# Altium schematic sheet HDMI_Extension_Schematics.SchDoc: HDMI level shifter
size B; Date: 4/26/2019; Author: Altay Brusan; CompanyName: Bogazici University; DrawnBy: Altay Brusan; Engineer: Altay Brusan; DocumentNumber: 1; Revision: 1; SheetNumber: 1; SheetTotal: 1; DocumentName: HDMI level shifter board; ProjectName: iBEX
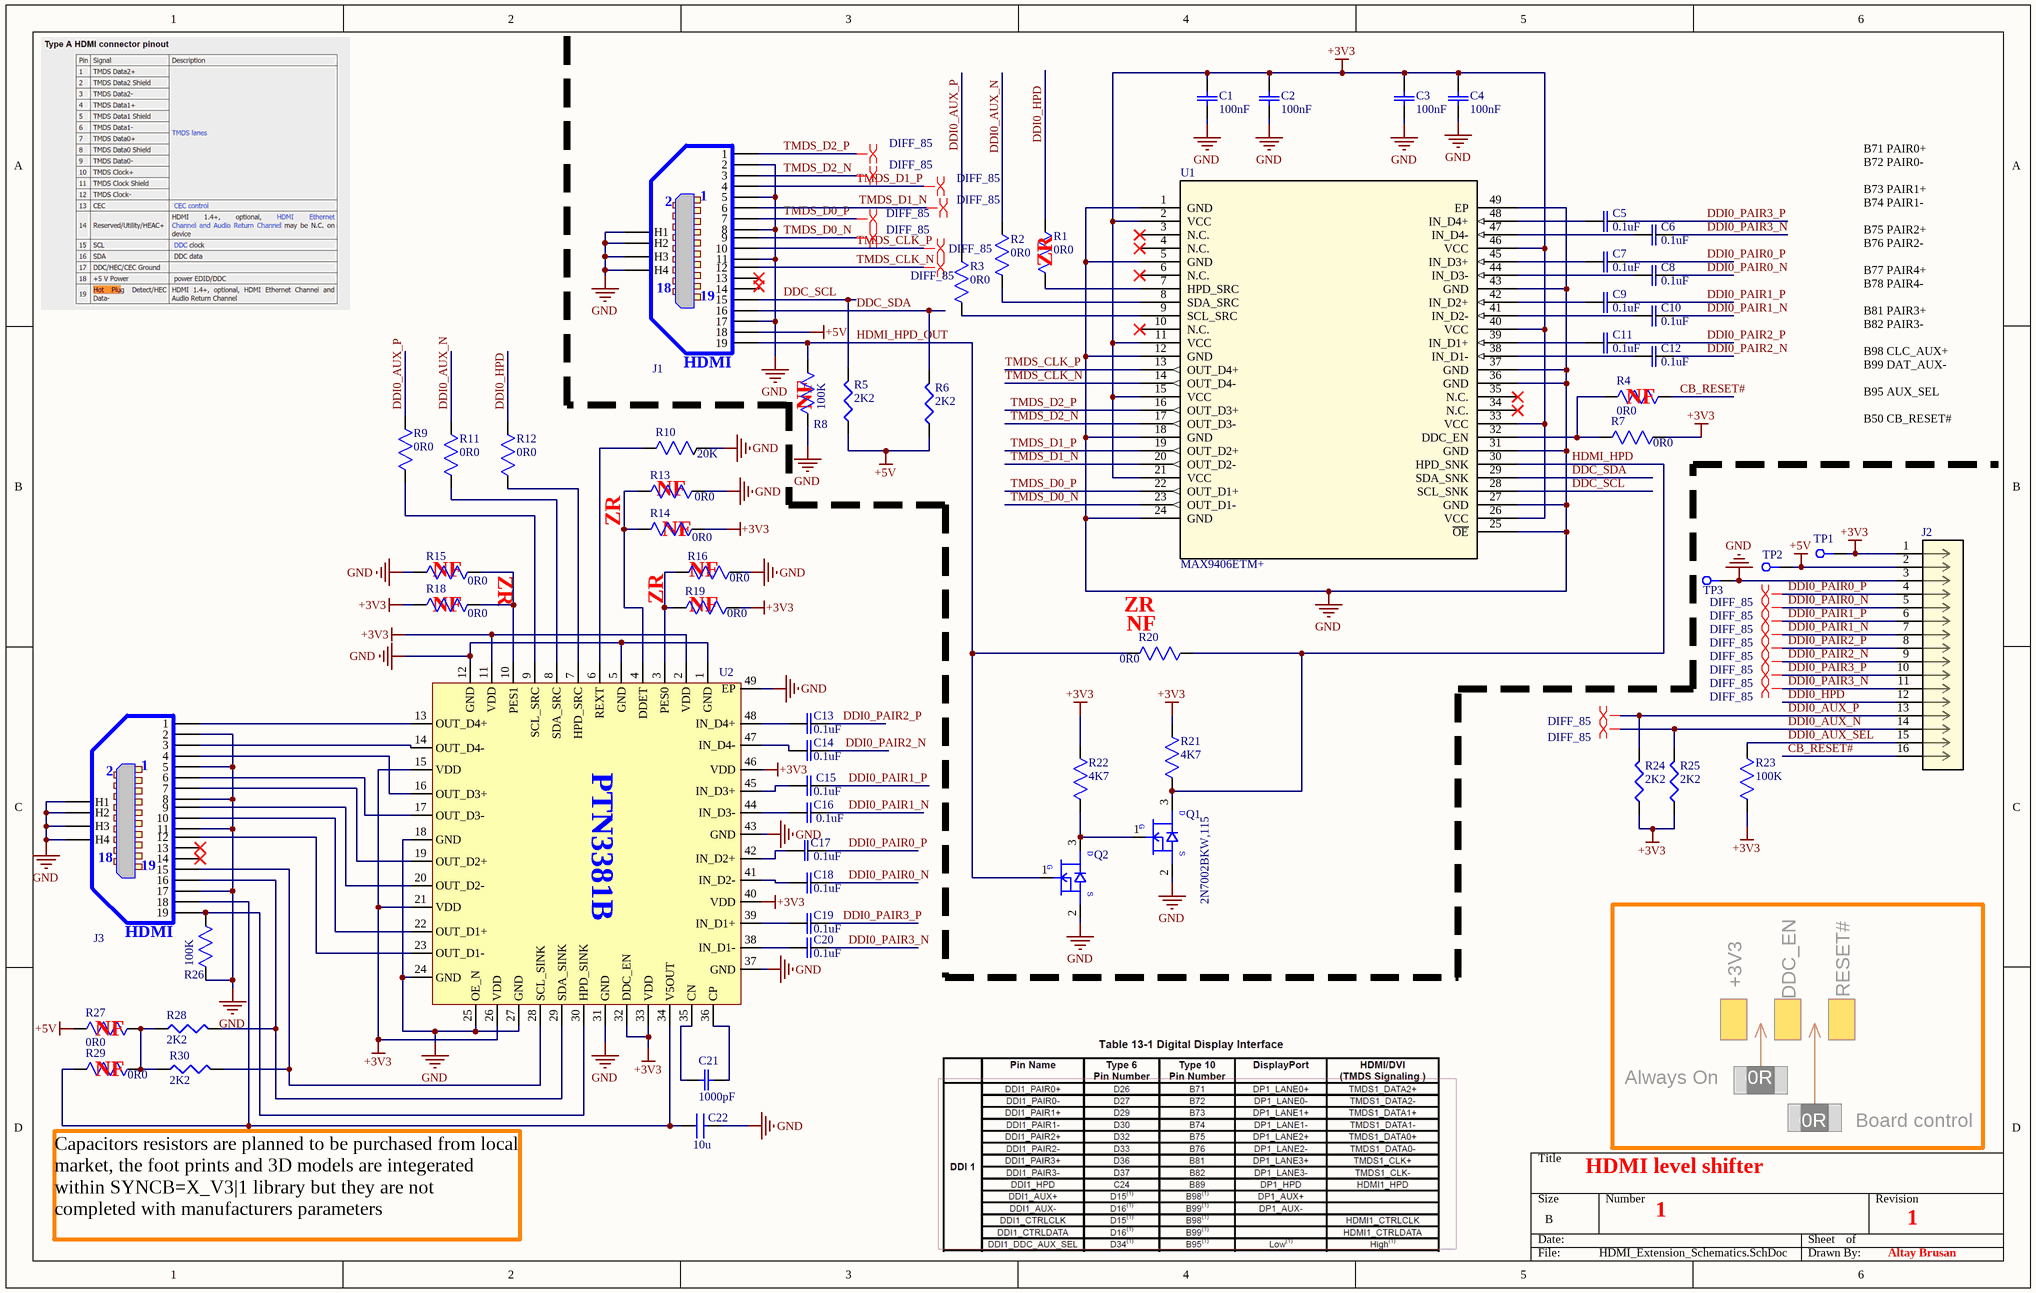
[diagram p0: HDMI_Extension_Schematics.SchDoc]

## Parts
C1  100nF  [STA_RMCF1206-M]
C2  100nF  [STA_RMCF1206-M]
C3  100nF  [STA_RMCF1206-M]
C4  100nF  [STA_RMCF1206-M]
C5  0.1uF  [CAP_3216]
C6  0.1uF  [CAP_3216]
C7  0.1uF  [CAP_3216]
C8  0.1uF  [CAP_3216]
C9  0.1uF  [CAP_3216]
C10  0.1uF  [CAP_3216]
C11  0.1uF  [CAP_3216]
C12  0.1uF  [CAP_3216]
C13  0.1uF  [CAP_3216]
C14  0.1uF  [CAP_3216]
C15  0.1uF  [CAP_3216]
C16  0.1uF  [CAP_3216]
C17  0.1uF  [CAP_3216]
C18  0.1uF  [CAP_3216]
C19  0.1uF  [CAP_3216]
C20  0.1uF  [CAP_3216]
C21  1000pF  [C1206]
C22  10u  [C1206]
J1  HDMI Connector  [HDMI_Thru]  (value not drawn)
J2  Part Number: FTS-108-01-F-D  [CON16_2x8_TU_FTS]  (value not drawn)
J3  HDMI Connector  [HDMI_Thru]  (value not drawn)
Q1  2N7002BKW,115  [SC70_SOT323]
Q2  2N7002BKW,115  [SC70_SOT323]  (value not drawn)
R1  0R0  [STA_RMCF1206-M]
R2  0R0  [STA_RMCF1206-M]
R3  0R0  [STA_RMCF1206-M]
R4  0R0  [STA_RMCF1206-M]
R5  2K2  [R1210]
R6  2K2  [R1210]
R7  0R0  [STA_RMCF1206-M]
R8  100K  [STA_RMCF1206-M]
R9  0R0  [STA_RMCF1206-M]
R10  20K  [STA_RMCF1206-M]
R11  0R0  [STA_RMCF1206-M]
R12  0R0  [STA_RMCF1206-M]
R13  0R0  [STA_RMCF1206-M]
R14  0R0  [STA_RMCF1206-M]
R15  0R0  [STA_RMCF1206-M]
R16  0R0  [STA_RMCF1206-M]
R18  0R0  [STA_RMCF1206-M]
R19  0R0  [STA_RMCF1206-M]
R20  0R0  [STA_RMCF1206-M]
R21  4K7  [STA_RMCF1206-M]
R22  4K7  [STA_RMCF1206-M]
R23  100K  [STA_RMCF1206-M]
R24  2K2  [R1206]
R25  2K2  [R1206]
R26  100K  [STA_RMCF1206-M]
R27  0R0  [STA_RMCF1206-M]
R28  2K2  [R1206]
R29  0R0  [STA_RMCF1206-M]
R30  2K2  [R1206]
TP1  TP_25MILC  [TP_25C]  (value not drawn)  (no BOM)
TP2  TP_25MILC  [TP_25C]  (value not drawn)  (no BOM)
TP3  TP_25MILC  [TP_25C]  (value not drawn)  (no BOM)
U1  MAX9406ETM+  [21-0144H_T4877-6]
U2  Interface - Specialized ENHNCD PERFORMANCE HDMI/DVI SHFTR V-REG  [HVQFN48]  (value not drawn)

## Nets
+3V3: C1.2 C2.2 C3.2 C4.2 J2.1 R7.2 R14.1 R18.2 R19.1 R21.1 R22.1 R23.2 R24.1 R25.1 TP1.1 U1.2(VCC) U1.11(VCC) U1.15(VCC) U1.21(VCC) U1.26(VCC) U1.33(VCC) U1.40(VCC) U1.46(VCC) U2.2(VDD) U2.11(VDD) U2.15(VDD) U2.21(VDD) U2.26(VDD) U2.32(DDC_EN) U2.33(VDD) U2.40(VDD) U2.46(VDD)
+5V: J1.18 J2.2 R5.1 R6.1 R27.2 TP2.1
GND: C1.1 C2.1 C3.1 C4.1 C22.2 J1.2 J1.5 J1.8 J1.11 J1.17 J1.H1 J1.H2 J1.H3 J1.H4 J2.3 J3.2 J3.5 J3.8 J3.11 J3.17 J3.H1 J3.H2 J3.H3 J3.H4 Q1.2(SOURCE) Q2.2(SOURCE) R8.2 R10.2 R13.1 R15.2 R16.1 R26.2 TP3.1 U1.1(GND) U1.5(GND) U1.12(GND) U1.18(GND) U1.24(GND) U1.25(~{OE}) U1.27(GND) U1.31(GND) U1.36(GND) U1.37(GND) U1.43(GND) U1.49(EP) U2.1(GND) U2.5(GND) U2.12(GND) U2.18(GND) U2.24(GND) U2.25(OE_N) U2.27(GND) U2.31(GND) U2.37(GND) U2.43(GND) U2.49(EP)
CB_RESET#: J2.16 R4.2
DDC_SCL: J1.15 R5.2 U1.28(SCL_SNK)
DDC_SDA: J1.16 R6.2 U1.29(SDA_SNK)
DDI0_AUX_N: J2.14 R2.2 R11.2 R25.2
DDI0_AUX_P: J2.13 R3.2 R9.2 R24.2
DDI0_AUX_SEL: J2.15 R23.1
DDI0_HPD: J2.12 R1.2 R12.2
DDI0_PAIR0_N: C8.2 C18.2 J2.5
DDI0_PAIR0_P: C7.2 C17.2 J2.4
DDI0_PAIR1_N: C10.2 C16.2 J2.7
DDI0_PAIR1_P: C9.2 C15.2 J2.6
DDI0_PAIR2_N: C12.2 C14.2 J2.9
DDI0_PAIR2_P: C11.2 C13.2 J2.8
DDI0_PAIR3_N: C6.2 C20.2 J2.11
DDI0_PAIR3_P: C5.2 C19.2 J2.10
HDMI_HPD: Q1.3(DRAIN) R20.2 R21.2 U1.30(HPD_SNK)
HDMI_HPD_OUT: J1.19 Q2.1(GATE) R8.1 R20.1
TMDS_CLK_N: J1.12 U1.14(OUT_D4-)
TMDS_CLK_P: J1.10 U1.13(OUT_D4+)
TMDS_D0_N: J1.9 U1.23(OUT_D1-)
TMDS_D0_P: J1.7 U1.22(OUT_D1+)
TMDS_D1_N: J1.6 U1.20(OUT_D2-)
TMDS_D1_P: J1.4 U1.19(OUT_D2+)
TMDS_D2_N: J1.3 U1.17(OUT_D3-)
TMDS_D2_P: J1.1 U1.16(OUT_D3+)
NetC5_1: C5.1 U1.48(IN_D4+)
NetC6_1: C6.1 U1.47(IN_D4-)
NetC7_1: C7.1 U1.45(IN_D3+)
NetC8_1: C8.1 U1.44(IN_D3-)
NetC9_1: C9.1 U1.42(IN_D2+)
NetC10_1: C10.1 U1.41(IN_D2-)
NetC11_1: C11.1 U1.39(IN_D1+)
NetC12_1: C12.1 U1.38(IN_D1-)
NetC13_1: C13.1 U2.48(IN_D4+)
NetC14_1: C14.1 U2.47(IN_D4-)
NetC15_1: C15.1 U2.45(IN_D3+)
NetC16_1: C16.1 U2.44(IN_D3-)
NetC17_1: C17.1 U2.42(IN_D2+)
NetC18_1: C18.1 U2.41(IN_D2-)
NetC19_1: C19.1 U2.39(IN_D1+)
NetC20_1: C20.1 U2.38(IN_D1-)
NetC21_1: C21.1 U2.36(CP)
NetC21_2: C21.2 U2.35(CN)
NetC22_1: C22.1 J3.18 R29.1 U2.34(V5OUT)
NetJ3_1: J3.1 U2.13(OUT_D4+)
NetJ3_3: J3.3 U2.14(OUT_D4-)
NetJ3_4: J3.4 U2.16(OUT_D3+)
NetJ3_6: J3.6 U2.17(OUT_D3-)
NetJ3_7: J3.7 U2.19(OUT_D2+)
NetJ3_9: J3.9 U2.20(OUT_D2-)
NetJ3_10: J3.10 U2.22(OUT_D1+)
NetJ3_12: J3.12 U2.23(OUT_D1-)
NetJ3_15: J3.15 R30.2 U2.28(SCL_SINK)
NetJ3_16: J3.16 R28.2 U2.29(SDA_SINK)
NetJ3_19: J3.19 R26.1 U2.30(HPD_SINK)
NetQ1_1: Q1.1(GATE) Q2.3(DRAIN) R22.2
NetR1_1: R1.1 U1.7(HPD_SRC)
NetR2_1: R2.1 U1.8(SDA_SRC)
NetR3_1: R3.1 U1.9(SCL_SRC)
NetR4_1: R4.1 R7.1 U1.32(DDC_EN)
NetR9_1: R9.1 U2.9(SCL_SRC)
NetR10_1: R10.1 U2.6(REXT)
NetR11_1: R11.1 U2.8(SDA_SRC)
NetR12_1: R12.1 U2.7(HPD_SRC)
NetR13_2: R13.2 R14.2 U2.4(DDET)
NetR15_1: R15.1 R18.1 U2.10(PES1)
NetR16_2: R16.2 R19.2 U2.3(PES0)
NetR27_1: R27.1 R28.1 R29.2 R30.1

Not connected (* = marked no-connect by the designer): J1 13* 14; J3 13* 14*; U1 3(N.C.)* 4(N.C.)* 6(N.C.)* 10(N.C.)* 34(N.C.)* 35(N.C.)*

## Layout directives
differential pair; net class DIFF_85: DDI0_AUX_N, DDI0_AUX_P, DDI0_PAIR0_N, DDI0_PAIR0_P, DDI0_PAIR1_N, DDI0_PAIR1_P, DDI0_PAIR2_N, DDI0_PAIR2_P, DDI0_PAIR3_N, DDI0_PAIR3_P, TMDS_CLK_N, TMDS_CLK_P, TMDS_D0_N, TMDS_D0_P, TMDS_D1_N, TMDS_D1_P, TMDS_D2_N, TMDS_D2_P

## Notes on the sheet
- (near R1) ZR
- (near R8) NF
- (near R4) NF
- B71 PAIR0+
  B72 PAIR0-
  B73 PAIR1+
  B74 PAIR1-
  B75 PAIR2+
  B76 PAIR2-
  B77 PAIR4+
  B78 PAIR4-
  B81 PAIR3+
  B82 PAIR3-
  B98 CLC_AUX+
  B99 DAT_AUX-
  B95 AUX_SEL
  B50 CB_RESET#
- (near R13) NF
- ZR
- (near R14) NF
- (near R15) NF
- (near R18) NF
- (near R16) NF
- (near R19) NF
- (near R20) ZR
- (near R20) NF
- +3V3
- DDC_EN
- RESET#
- (near R27) NF
- (near R29) NF
- Always On
- 0R
- Board control
- Capacitors resistors are planned to be purchased from local market, the foot prints and 3D models are integerated within SYNCB=X_V3|1 library but they are not completed with manufacturers parameters
- 1
- (in symbol 2N7002BKW,115) D; G; S
- (in symbol HDMI_Connector) HDMI

## Library data of the parts
C1-C4 = CL05A104KA5NNNC: CAP CER 0.1UF 50V X8R 0603; Manufacturer 1: Samsung Electro-Mechanics; Tolerance: ±10%; Voltage - Rated: 25V; Temperature Coefficient: X5R; Notification: Current market demand for these product types have resulted in fluctuating and extending lead times. Lead times may differ.; Description 1: CAP CER 0.1UF 25V X5R 0402; Manufacturer Part Number 1: CL05A104KA5NNNC; RoHS: RoHS Compliant; Stock 1: 100000; Pricing 1: 1=0.1, 10=0.04, 100=0.0176, 500=0.0126, 1000=0.0099, 2500=0.009, 5000=0.00828 (USD); Packaging: Digi-Reel®; Part Status: Active; Operating Temperature: -55°C ~ 85°C; Features: -; Ratings: -; Applications: General Purpose; Mounting Type: Surface Mount, MLCC; Package / Case: 0402 (1005 Metric); Size / Dimension: 0.039" L x 0.020" W (1.00mm x 0.50mm); Height - Seated (Max): -; Thickness (Max): 0.022" (0.55mm); Lead Spacing: -; Lead Style: -; ComponentLink1URL: http://www.samsungsem.com/kr/support/product-search/mlcc/CL05A104KA5NNNC.jsp; ComponentLink1Description: http://www.samsungsem.com/kr/support/product-search/mlcc/CL05A104KA5NNNC.jsp; Supplier 1: Digi-Key; Supplier Part Number 1: 1276-1043-6-ND; Category: Capacitors
C5-C20 = C3216X8R2A104K11: CAP CER 0.1UF 100V X8R 1206; Manufacturer_Part_Number: C3216X8R2A104K115AA; Vendor: TDK; Built_By: EMA_UL_Team; Type: DEV; Copyright: Copyright (C) 2018 Accelerated Designs. All rights reserved; RefDes: RefDes; Value: Value
C21 = C1206X102KGRACAUTO: CAP CER 1206 1NF 2000V X7R 10% F; Manufacturer 1: KEMET; Voltage - Rated: 2000V (2kV); Manufacturer Part Number 1: C1206X102KGRACAUTO; Stock 1: 7503; Tolerance: ±10%; Applications: Automotive, Boardflex Sensitive; Mounting Type: Surface Mount, MLCC; Package / Case: 1206 (3216 Metric); Category: Capacitors; RoHS: RoHS Compliant; Pricing 1: 1=0.79, 10=0.58, 100=0.3974, 500=0.31464, 1000=0.26496 (USD); Packaging: Cut Tape (CT); Part Status: Active; Temperature Coefficient: X7R; Operating Temperature: -55°C ~ 125°C; Features: Low ESL, Soft Termination, High Voltage; Ratings: AEC-Q200; Failure Rate: -; Size / Dimension: 0.130" L x 0.063" W (3.30mm x 1.60mm); Height - Seated (Max): -; Thickness (Max): 0.073" (1.85mm); Lead Spacing: -; Lead Style: -; ComponentLink1URL: https://api.kemet.com/component-edge/download/datasheet/C1206X102KGRACAUTO.pdf; ComponentLink1Description: https://api.kemet.com/component-edge/download/datasheet/C1206X102KGRACAUTO.pdf; Supplier 1: Digi-Key; Supplier Part Number 1: 399-16730-1-ND; Description 1: CAP CER 1206 1NF 2000V X7R 10% F
C22 = C1608X5R0J106M: CAP CER 10UF 6.3V X5R 20% 0603; Manufacturer: TDK Corporation; Capacitance: 10µF; Value: 10µF; .Checked PCB: used; Category: Capacitors; Manufacturer Part Number: C1608X5R0J106M; Tolerance: ±20%; Mounting Type: Surface Mount, MLCC; Supplier Part Number: 445-4112-1-ND; Operating Temperature: -55°C ~ 85°C; Package / Case: 0603 (1608 Metric); Price 1k [$]: 0.08580; .Checked SCH: used; Voltage - Rated: 6.3V; Features: Low ESR; Supplier: Digikey; Supplier 1: Digi-Key; Supplier Part Number 1: 445-4112-1-ND; RoHS: RoHS Compliant; Stock 1: 48157; Pricing 1: 1=0.46, 10=0.363, 100=0.1898, 250=0.14024, 500=0.1089, 1000=0.0858 (USD); Temperature Coefficient: X5R; Applications: General Purpose; Ratings: -; Size / Dimension: 0.063" L x 0.031" W (1.60mm x 0.80mm); Height - Seated (Max): -; Thickness (Max): 0.037" (0.95mm); Lead Spacing: -; Packaging: Cut Tape (CT); Lead Style: -; ComponentLink1URL: http://www.tdk.com/pdf/general_B11.pdf; ComponentLink1Description: http://www.tdk.com/pdf/general_B11.pdf
J1 J3 = HDMI_Connector
J2 = FTS-108-01-F-D: No Description Available; Vendor: Samtec Inc; Built_By: EMA_UL_Team; Manufacturer_Part_Number: FTS-108-01-F-D; Copyright: Copyright (C) 2018 Accelerated Designs. All rights reserved; RefDes: RefDes; Type: DEV; Value: Value
Q1 Q2 = 2N7002BKW,115: MOSFET N-CH 60V 310MA SOT323; Manufacturer: NXP Semiconductors; FET Type: MOSFET N-Channel, Metal Oxide; FET Feature: Logic Level Gate; Rds On (Max) @ Id, Vgs: 1.6 Ohm @ 500mA, 10V; Vgs(th) (Max) @ Id: 2.1V @ 250µA; Gate Charge (Qg) @ Vgs: 0.6nC @ 4.5V; Input Capacitance (Ciss) @ Vds: 50pF @ 10V; Power - Max: 275mW; .Checked PCB: RF; Supplier 1: Digi-Key; Supplier Part Number 1: 568-5980-1-ND; Manufacturer Part Number: 2N7002BKW,115; RoHS: RoHS Compliant; Category: Discrete Semiconductor Products; Stock 1: 15666; Pricing 1: 1=0.39, 10=0.354, 25=0.2548, 100=0.1983, 250=0.12456, 500=0.10616, 1000=0.07233 (USD); Drain to Source Voltage (Vdss): 60V; Current - Continuous Drain (Id) @ 25° C: 310mA; Mounting Type: Surface Mount; Package / Case: SC-70, SOT-323; Supplier Device Package: SC-70; Packaging: Cut Tape (CT); ComponentLink1URL: http://www.nxp.com/documents/data_sheet/2N7002BKW.pdf; ComponentLink1Description: http://www.nxp.com/documents/data_sheet/2N7002BKW.pdf; .Checked SCH: RF
R1-R4 R9 R11 R12 R20 = RMCF1206JT390R: No Description Available; Manufacturer 1: Stackpole-Electronics-Inc.; Vendor: Stackpole International; Built_By: EMA_UL_Team; Resistance (Ohms): 390; Tolerance: ±5%; Power (Watts): 0.25W, 1/4W; Temperature Coefficient: ±200ppm/°C; Manufacturer_Part_Number: RMCF1206JT390R; Copyright: Copyright (C) 2018 Accelerated Designs. All rights reserved; RefDes: RefDes; Type: DEV; Value: Value; Manufacturer Part Number 1: RMCF1206JT390R; Stock 1: 15000; Pricing 1: 5000=0.004, 25000=0.0038, 50000=0.0035, 125000=0.0031, 250000=0.0028 (USD); Family: Chip Resistor - Surface Mount; Series: RMCF; Packaging: Digi-Reel®; Composition: Thick Film; Features: Automotive AEC-Q200; Operating Temperature: -55°C ~ 155°C; Package / Case: 1206 (3216 Metric); Supplier Device Package: 1206; Size / Dimension: 0.126" L x 0.063" W (3.20mm x 1.60mm); Height: 0.028" (0.70mm); Number of Terminations: 2; Supplier 1: Future Electronics; Supplier Part Number 1: RMCF1206JT390R-REEL; Category: Resistors
R5 R6 = RC1005F222CS: RES.(3225) 1210 2.2K Ohms 1% 1/3W-S 100PPM; Tolerance: ±1%; Package / Case: 1210
R7 R13-R16 R18 R19 R27 R29 = RMCF1206JT390R: No Description Available; Manufacturer 1: Stackpole-Electronics-Inc.; Built_By: EMA_UL_Team; Tolerance: ±5%; Temperature Coefficient: ±200ppm/°C; Vendor: Stackpole International; Resistance (Ohms): 390; Power (Watts): 0.25W, 1/4W; Supplier Device Package: 1206; Supplier Part Number 1: RMCF1206JT390R-REEL; Category: Resistors; Manufacturer_Part_Number: RMCF1206JT390R; Copyright: Copyright (C) 2018 Accelerated Designs. All rights reserved; RefDes: RefDes; Type: DEV; Value: Value; Manufacturer Part Number 1: RMCF1206JT390R; Stock 1: 15000; Pricing 1: 5000=0.004, 25000=0.0038, 50000=0.0035, 125000=0.0031, 250000=0.0028 (USD); Family: Chip Resistor - Surface Mount; Series: RMCF; Packaging: Digi-Reel®; Composition: Thick Film; Features: Automotive AEC-Q200; Operating Temperature: -55°C ~ 155°C; Package / Case: 1206 (3216 Metric); Size / Dimension: 0.126" L x 0.063" W (3.20mm x 1.60mm); Height: 0.028" (0.70mm); Number of Terminations: 2; Supplier 1: Future Electronics
R8 R23 R26 = RC2012F104CS: RES.(3216) 1206 100K Ohms 1% 1/4W-S 100PPM; Tolerance: ±1%
  R8 R23: Package / Case: 1206
  R26: Supplier Device Package: 1206
R10 = RC2012F203CS: RES.(3216) 1206 20K Ohms 1% 1/4W-S 100PPM; Tolerance: ±1%; Supplier Device Package: 1206
R21 R22 = CRG0805F4K7: RES SMD 4.7K OHM 1% 1/8W 0805; Manufacturer 1: TE Connectivity Passive Product; Vendor: TE Connectivity; Built_By: EMA_UL_Team; C: Copyright (C) 2015 Accelerated Designs. All rights reserved; Power (Watts): 0.125W, 1/8W; Temperature Coefficient: ±100ppm/°C; Manufacturer_Part_Number: CRG0805F4K7; RefDes: RefDes; Type: DEV; Value: Value; Manufacturer Part Number 1: CRG0805F4K7; RoHS: RoHS Compliant; Stock 1: 28633; Pricing 1: 1=0.1, 10=0.035, 100=0.0143, 1000=0.00641, 2500=0.00557 (USD); Packaging: Cut Tape (CT); Part Status: Active; Tolerance: ±1%; Composition: Thick Film; Features: -; Operating Temperature: -55°C ~ 125°C; Package / Case: 0805 (2012 Metric); Supplier Device Package: 0805; Size / Dimension: 0.079" L x 0.049" W (2.00mm x 1.25mm); Height - Seated (Max): 0.026" (0.65mm); Failure Rate: -; ComponentLink1URL: http://www.te.com/commerce/DocumentDelivery/DDEController?Action=srchrtrv&DocNm=1773204&DocType=DS&DocLang=English; ComponentLink1Description: http://www.te.com/commerce/DocumentDelivery/DDEController?Action=srchrtrv&DocNm=1773204&DocType=DS&DocLang=English; Supplier 1: Digi-Key; Supplier Part Number 1: A106065CT-ND; Description 1: RES SMD 4.7K OHM 1% 1/8W 0805; Category: Resistors
R24 R25 R28 R30 = RC1005F222CS: RES.(3216) 1206 2.2K Ohms 1% 1/4W-S 100PPM; Tolerance: ±1%
  R24 R25: Package / Case: 1206
  R28 R30: Supplier Device Package: 1206
TP1-TP3 = TP_25MILC: Test Point 25mil
U1 = MAX9406ETM+: IC DVI/HDMI LVL SHIFTR 48TQFN; Manufacturer 1: Maxim Integrated; Manufacturer Part Number 1: MAX9406ETM+; RoHS: RoHS Compliant; Stock 1: 162; Pricing 1: 1=3.75, 10=3.563, 25=2.94, 50=2.793, 250=2.70752, 500=2.44832 (USD); Packaging: Tube; Part Status: Active; Type: Level Shifter; Applications: Base Stations; Mounting Type: Surface Mount; Package / Case: 48-WFQFN Exposed Pad; Supplier Device Package: 48-TQFN (7x7); Base Part Number: MAX9406; ComponentLink1URL: https://datasheets.maximintegrated.com/en/ds/MAX9406.pdf; ComponentLink1Description: https://datasheets.maximintegrated.com/en/ds/MAX9406.pdf; Supplier 1: Digi-Key; Supplier Part Number 1: MAX9406ETM+-ND; Description 1: IC DVI/HDMI LVL SHIFTR 48TQFN; Category: Integrated Circuits (ICs)
U2 = PTN3381B: Manufacturer 1: NXP; Manufacturer Part Number 1: PTN3381BBS,518; Brand: NXP Semiconductors; RoHS: RoHS Compliant; Stock 1: 2570; Pricing 1: 1=1.94, 10=1.65, 100=1.32, 500=1.15, 1000=0.952, 4000=0.854, 8000=0.821 (USD); Packaging: Cut Tape; Product Type: Interface - Specialized; Standard Pack Qty: 4000; Subcategory: Interface ICs; RoHS - Mouser: Y; Minimum Order Quantity: 1; Reeling: True; ComponentLink1URL: https://www.mouser.com/datasheet/2/302/PTN3381B-1127737.pdf; ComponentLink1Description: https://www.mouser.com/datasheet/2/302/PTN3381B-1127737.pdf; Supplier 1: Mouser; Supplier Part Number 1: 771-PTN3381BBS518; Description 1: Interface - Specialized ENHNCD PERFORMANCE HDMI/DVI SHFTR V-REG; Category: Interface - Specialized